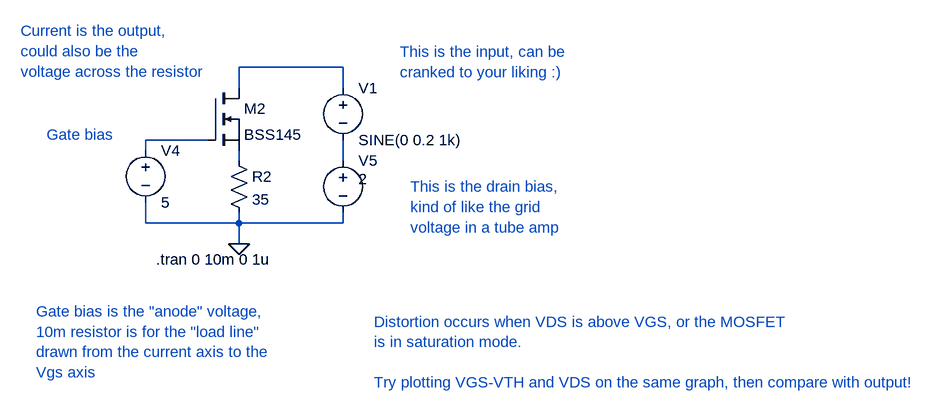
[diagram p0: schematic BSS145.asc]
BSS145.asc, the LTspice schematic file:
Version 4
SHEET 1 2308 740
WIRE 1360 112 1200 112
WIRE 1200 144 1200 112
WIRE 1360 144 1360 112
WIRE 1152 224 1056 224
WIRE 1056 240 1056 224
WIRE 1200 256 1200 240
WIRE 1360 256 1360 224
WIRE 1056 352 1056 320
WIRE 1200 352 1200 336
WIRE 1200 352 1056 352
WIRE 1360 352 1360 336
WIRE 1360 352 1200 352
WIRE 1200 384 1200 352
FLAG 1200 384 0
SYMBOL nmos 1152 144 R0
SYMATTR InstName M2
SYMATTR Value BSS145
SYMBOL voltage 1056 224 R0
WINDOW 123 0 0 Left 0
WINDOW 39 0 0 Left 0
SYMATTR InstName V4
SYMATTR Value 5
SYMBOL voltage 1360 240 R0
WINDOW 123 0 0 Left 0
WINDOW 39 0 0 Left 0
WINDOW 3 24 44 Left 2
SYMATTR InstName V5
SYMATTR Value 2
SYMBOL res 1184 240 R0
SYMATTR InstName R2
SYMATTR Value 35
SYMBOL voltage 1360 128 R0
WINDOW 123 0 0 Left 0
WINDOW 39 0 0 Left 0
SYMATTR InstName V1
SYMATTR Value SINE(0 0.2 1k)
TEXT 1072 408 Left 2 !.tran 0 10m 0 1u
TEXT 1464 296 Left 2 ;This is the drain bias,\nkind of like the grid\nvoltage in a tube amp
TEXT 1448 88 Left 2 ;This is the input, can be\ncranked to your liking :)
TEXT 864 56 Left 2 ;Current is the output,\ncould also be the \nvoltage across the resistor
TEXT 904 216 Left 2 ;Gate bias
TEXT 888 488 Left 2 ;Gate bias is the "anode" voltage,\n10m resistor is for the "load line"\ndrawn from the current axis to the\nVgs axis
TEXT 1408 504 Left 2 ;Distortion occurs when VDS is above VGS, or the MOSFET\nis in saturation mode.\n \nTry plotting VGS-VTH and VDS on the same graph, then compare with output!

The netlist it stands for:
* BSS145.asc
M2 N001 N002 N003 N003 BSS145
V4 N002 0 5
V5 N004 0 2
R2 N003 0 35
V1 N001 N004 SINE(0 0.2 1k)
.model NMOS NMOS
.model PMOS PMOS
.lib standard.mos
.tran 0 10m 0 1u
* This is the drain bias,
* kind of like the grid
* voltage in a tube amp
* This is the input, can be
* cranked to your liking :)
* Current is the output,
* could also be the
* voltage across the resistor
* Gate bias
* Gate bias is the "anode" voltage,
* 10m resistor is for the "load line"
* drawn from the current axis to the
* Vgs axis
* Distortion occurs when VDS is above VGS, or the MOSFET
* is in saturation mode.
* Try plotting VGS-VTH and VDS on the same graph, then compare with output!
.backanno
.end